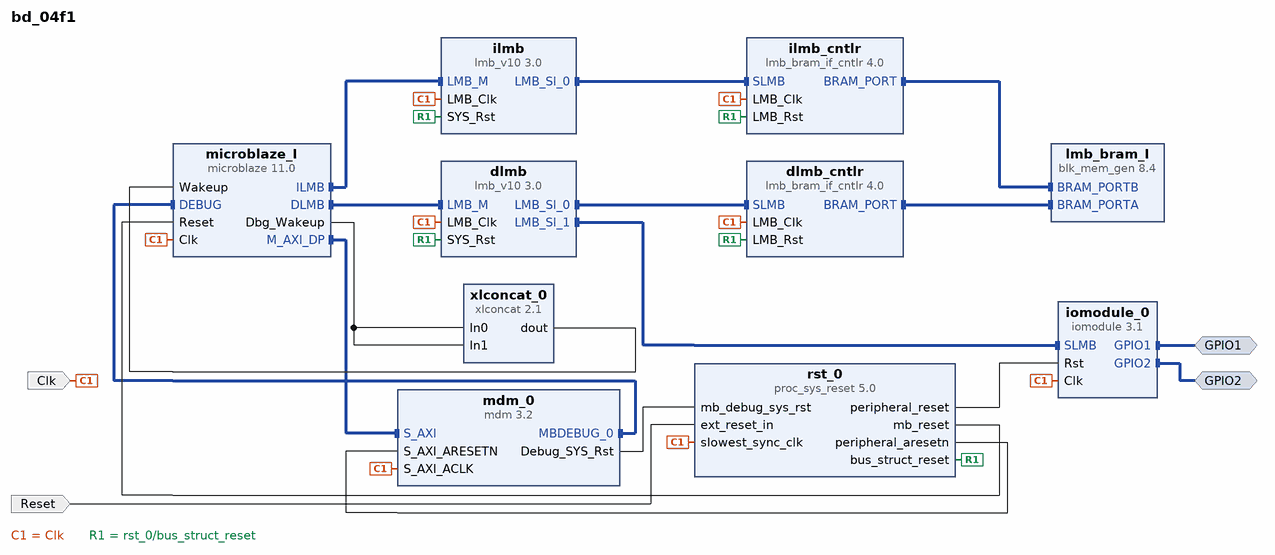
[diagram p0: block diagram of the top level]
# Vivado block design bd_04f1, xczu29dr-ffvf1760-2-e, Vivado 2019.1
create_bd_design bd_04f1

create_bd_intf_port -mode Master -vlnv xilinx.com:interface:gpio_rtl:1.0 GPIO1
set_property -dict [list \
  CONFIG.C_GPI1_INTERRUPT 0 \
  CONFIG.C_GPI1_SIZE 32 \
  CONFIG.C_GPO1_INIT 0x00000000 \
  CONFIG.C_GPO1_SIZE 8 \
  CONFIG.C_USE_GPI1 0 \
  CONFIG.C_USE_GPO1 1 \
] [get_bd_intf_ports GPIO1]
create_bd_intf_port -mode Master -vlnv xilinx.com:interface:gpio_rtl:1.0 GPIO2
set_property -dict [list \
  CONFIG.C_GPI2_INTERRUPT 0 \
  CONFIG.C_GPI2_SIZE 32 \
  CONFIG.C_GPO2_INIT 0x00000000 \
  CONFIG.C_GPO2_SIZE 16 \
  CONFIG.C_USE_GPI2 0 \
  CONFIG.C_USE_GPO2 1 \
] [get_bd_intf_ports GPIO2]
create_bd_port -dir I -type clk Clk
set_property -dict {CONFIG.ASSOCIATED_ASYNC_RESET Reset} [get_bd_ports Clk]
create_bd_port -dir I -type rst Reset

create_bd_cell -type ip -vlnv xilinx.com:ip:microblaze:11.0 microblaze_I
set_property -dict [list \
  CONFIG.C_AREA_OPTIMIZED 1 \
  CONFIG.C_ASYNC_WAKEUP 3 \
  CONFIG.C_D_AXI 1 \
  CONFIG.C_ENABLE_DISCRETE_PORTS 1 \
  CONFIG.C_FAULT_TOLERANT 0 \
  CONFIG.C_INSTANCE mb_microblaze_0 \
  CONFIG.C_PC_WIDTH 17 \
  CONFIG.C_USE_REORDER_INSTR 0 \
] [get_bd_cells microblaze_I]
create_bd_cell -type ip -vlnv xilinx.com:ip:proc_sys_reset:5.0 rst_0
create_bd_cell -type ip -vlnv xilinx.com:ip:lmb_v10:3.0 ilmb
create_bd_cell -type ip -vlnv xilinx.com:ip:lmb_v10:3.0 dlmb
set_property -dict {CONFIG.C_LMB_NUM_SLAVES 2} [get_bd_cells dlmb]
create_bd_cell -type ip -vlnv xilinx.com:ip:lmb_bram_if_cntlr:4.0 dlmb_cntlr
set_property -dict [list \
  CONFIG.C_BASEADDR 0x0000000000000000 \
  CONFIG.C_HIGHADDR 0x000000000001FFFF \
  CONFIG.C_MASK 0x00000000C0000000 \
] [get_bd_cells dlmb_cntlr]
create_bd_cell -type ip -vlnv xilinx.com:ip:lmb_bram_if_cntlr:4.0 ilmb_cntlr
set_property -dict [list \
  CONFIG.C_BASEADDR 0x0000000000000000 \
  CONFIG.C_HIGHADDR 0x000000000001FFFF \
  CONFIG.C_MASK 0x0000000080000000 \
] [get_bd_cells ilmb_cntlr]
create_bd_cell -type ip -vlnv xilinx.com:ip:blk_mem_gen:8.4 lmb_bram_I
set_property -dict {CONFIG.Memory_Type True_Dual_Port_RAM} [get_bd_cells lmb_bram_I]
create_bd_cell -type ip -vlnv xilinx.com:ip:mdm:3.2 mdm_0
set_property -dict {CONFIG.C_USE_UART 1} [get_bd_cells mdm_0]
create_bd_cell -type ip -vlnv xilinx.com:ip:xlconcat:2.1 xlconcat_0
create_bd_cell -type ip -vlnv xilinx.com:ip:iomodule:3.1 iomodule_0
set_property -dict [list \
  CONFIG.C_BASEADDR 0x0000000080000000 \
  CONFIG.C_GPO1_SIZE 8 \
  CONFIG.C_GPO2_SIZE 16 \
  CONFIG.C_HIGHADDR 0x000000008000FFFF \
  CONFIG.C_INSTANCE iomodule \
  CONFIG.C_INTC_ADDR_WIDTH 17 \
  CONFIG.C_INTC_HAS_FAST 1 \
  CONFIG.C_INTC_USE_IRQ_OUT 1 \
  CONFIG.C_IO_BASEADDR 0x00000000C0000000 \
  CONFIG.C_IO_HIGHADDR 0x00000000FFFFFFFF \
  CONFIG.C_IO_MASK 0x00000000C0000000 \
  CONFIG.C_MASK 0x00000000C0000000 \
  CONFIG.C_USE_GPO1 1 \
  CONFIG.C_USE_GPO2 1 \
] [get_bd_cells iomodule_0]

# ---- connections ----

connect_bd_intf_net [get_bd_intf_ports GPIO2] [get_bd_intf_pins iomodule_0/GPIO2]
connect_bd_intf_net -intf_net microblaze_I_mdm_bus [get_bd_intf_pins mdm_0/MBDEBUG_0] [get_bd_intf_pins microblaze_I/DEBUG]
connect_bd_intf_net [get_bd_intf_pins microblaze_I/ILMB] [get_bd_intf_pins ilmb/LMB_M]
connect_bd_intf_net [get_bd_intf_pins microblaze_I/DLMB] [get_bd_intf_pins dlmb/LMB_M]
connect_bd_intf_net -intf_net dlmb_sl_0 [get_bd_intf_pins dlmb/LMB_Sl_0] [get_bd_intf_pins dlmb_cntlr/SLMB]
connect_bd_intf_net [get_bd_intf_ports GPIO1] [get_bd_intf_pins iomodule_0/GPIO1]
connect_bd_intf_net -intf_net ilmb_port [get_bd_intf_pins ilmb_cntlr/BRAM_PORT] [get_bd_intf_pins lmb_bram_I/BRAM_PORTB]
connect_bd_intf_net -intf_net dlmb_port [get_bd_intf_pins dlmb_cntlr/BRAM_PORT] [get_bd_intf_pins lmb_bram_I/BRAM_PORTA]
connect_bd_intf_net [get_bd_intf_pins microblaze_I/M_AXI_DP] [get_bd_intf_pins mdm_0/S_AXI]
connect_bd_intf_net -intf_net dlmb_sl_1 [get_bd_intf_pins dlmb/LMB_Sl_1] [get_bd_intf_pins iomodule_0/SLMB]
connect_bd_intf_net -intf_net ilmb_sl_0 [get_bd_intf_pins ilmb/LMB_Sl_0] [get_bd_intf_pins ilmb_cntlr/SLMB]
connect_bd_net [get_bd_ports Clk] \
  [get_bd_pins microblaze_I/Clk] [get_bd_pins ilmb/LMB_Clk] [get_bd_pins dlmb/LMB_Clk] [get_bd_pins dlmb_cntlr/LMB_Clk] \
  [get_bd_pins ilmb_cntlr/LMB_Clk] [get_bd_pins iomodule_0/Clk] [get_bd_pins rst_0/slowest_sync_clk] \
  [get_bd_pins mdm_0/S_AXI_ACLK]
connect_bd_net [get_bd_ports Reset] [get_bd_pins rst_0/ext_reset_in]
connect_bd_net -net MB_Reset [get_bd_pins rst_0/mb_reset] [get_bd_pins microblaze_I/Reset]
connect_bd_net -net LMB_Rst1 [get_bd_pins rst_0/bus_struct_reset] \
  [get_bd_pins ilmb/SYS_Rst] [get_bd_pins dlmb/SYS_Rst] [get_bd_pins ilmb_cntlr/LMB_Rst] [get_bd_pins dlmb_cntlr/LMB_Rst]
connect_bd_net -net IO_Rst [get_bd_pins rst_0/peripheral_reset] [get_bd_pins iomodule_0/Rst]
connect_bd_net -net mdm_0_ARESETN [get_bd_pins rst_0/peripheral_aresetn] [get_bd_pins mdm_0/S_AXI_ARESETN]
connect_bd_net -net Dbg_Wakeup [get_bd_pins microblaze_I/Dbg_Wakeup] [get_bd_pins xlconcat_0/In0] [get_bd_pins xlconcat_0/In1]
connect_bd_net -net Wakeup [get_bd_pins xlconcat_0/dout] [get_bd_pins microblaze_I/Wakeup]
connect_bd_net -net Debug_SYS_Rst [get_bd_pins mdm_0/Debug_SYS_Rst] [get_bd_pins rst_0/mb_debug_sys_rst]
set_property HDL_ATTRIBUTE.BMM_INFO_PROCESSOR {microblaze-le > bd_04f1 dlmb_cntlr} [get_bd_cells microblaze_I]
set_property HDL_ATTRIBUTE.KEEP_HIERARCHY yes [get_bd_cells microblaze_I]
set_property HDL_ATTRIBUTE.BMM_INFO_ADDRESS_SPACE {byte  0x00000000 32 > bd_04f1 lmb_bram_I} [get_bd_cells dlmb_cntlr]
set_property HDL_ATTRIBUTE.KEEP_HIERARCHY yes [get_bd_cells dlmb_cntlr]

# ---- address map ----
assign_bd_address -offset 0x00000000 -range 128K -target_address_space [get_bd_addr_spaces microblaze_I/Data] [get_bd_addr_segs dlmb_cntlr/SLMB/Mem]
assign_bd_address -offset 0x40000000 -range 64K -target_address_space [get_bd_addr_spaces microblaze_I/Data] [get_bd_addr_segs mdm_0/S_AXI/Reg]
assign_bd_address -offset 0x80000000 -range 64K -target_address_space [get_bd_addr_spaces microblaze_I/Data] [get_bd_addr_segs iomodule_0/SLMB/Reg]
assign_bd_address -offset 0x00000000 -range 128K -target_address_space [get_bd_addr_spaces microblaze_I/Instruction] [get_bd_addr_segs ilmb_cntlr/SLMB/Mem]

validate_bd_design
save_bd_design
